# Altium project KlusterLab r2.0.PrjPcb (part 6 of 10)

## Sheet System Clocks.SchDoc
size A3; SheetNumber: 29; SheetTotal: 32
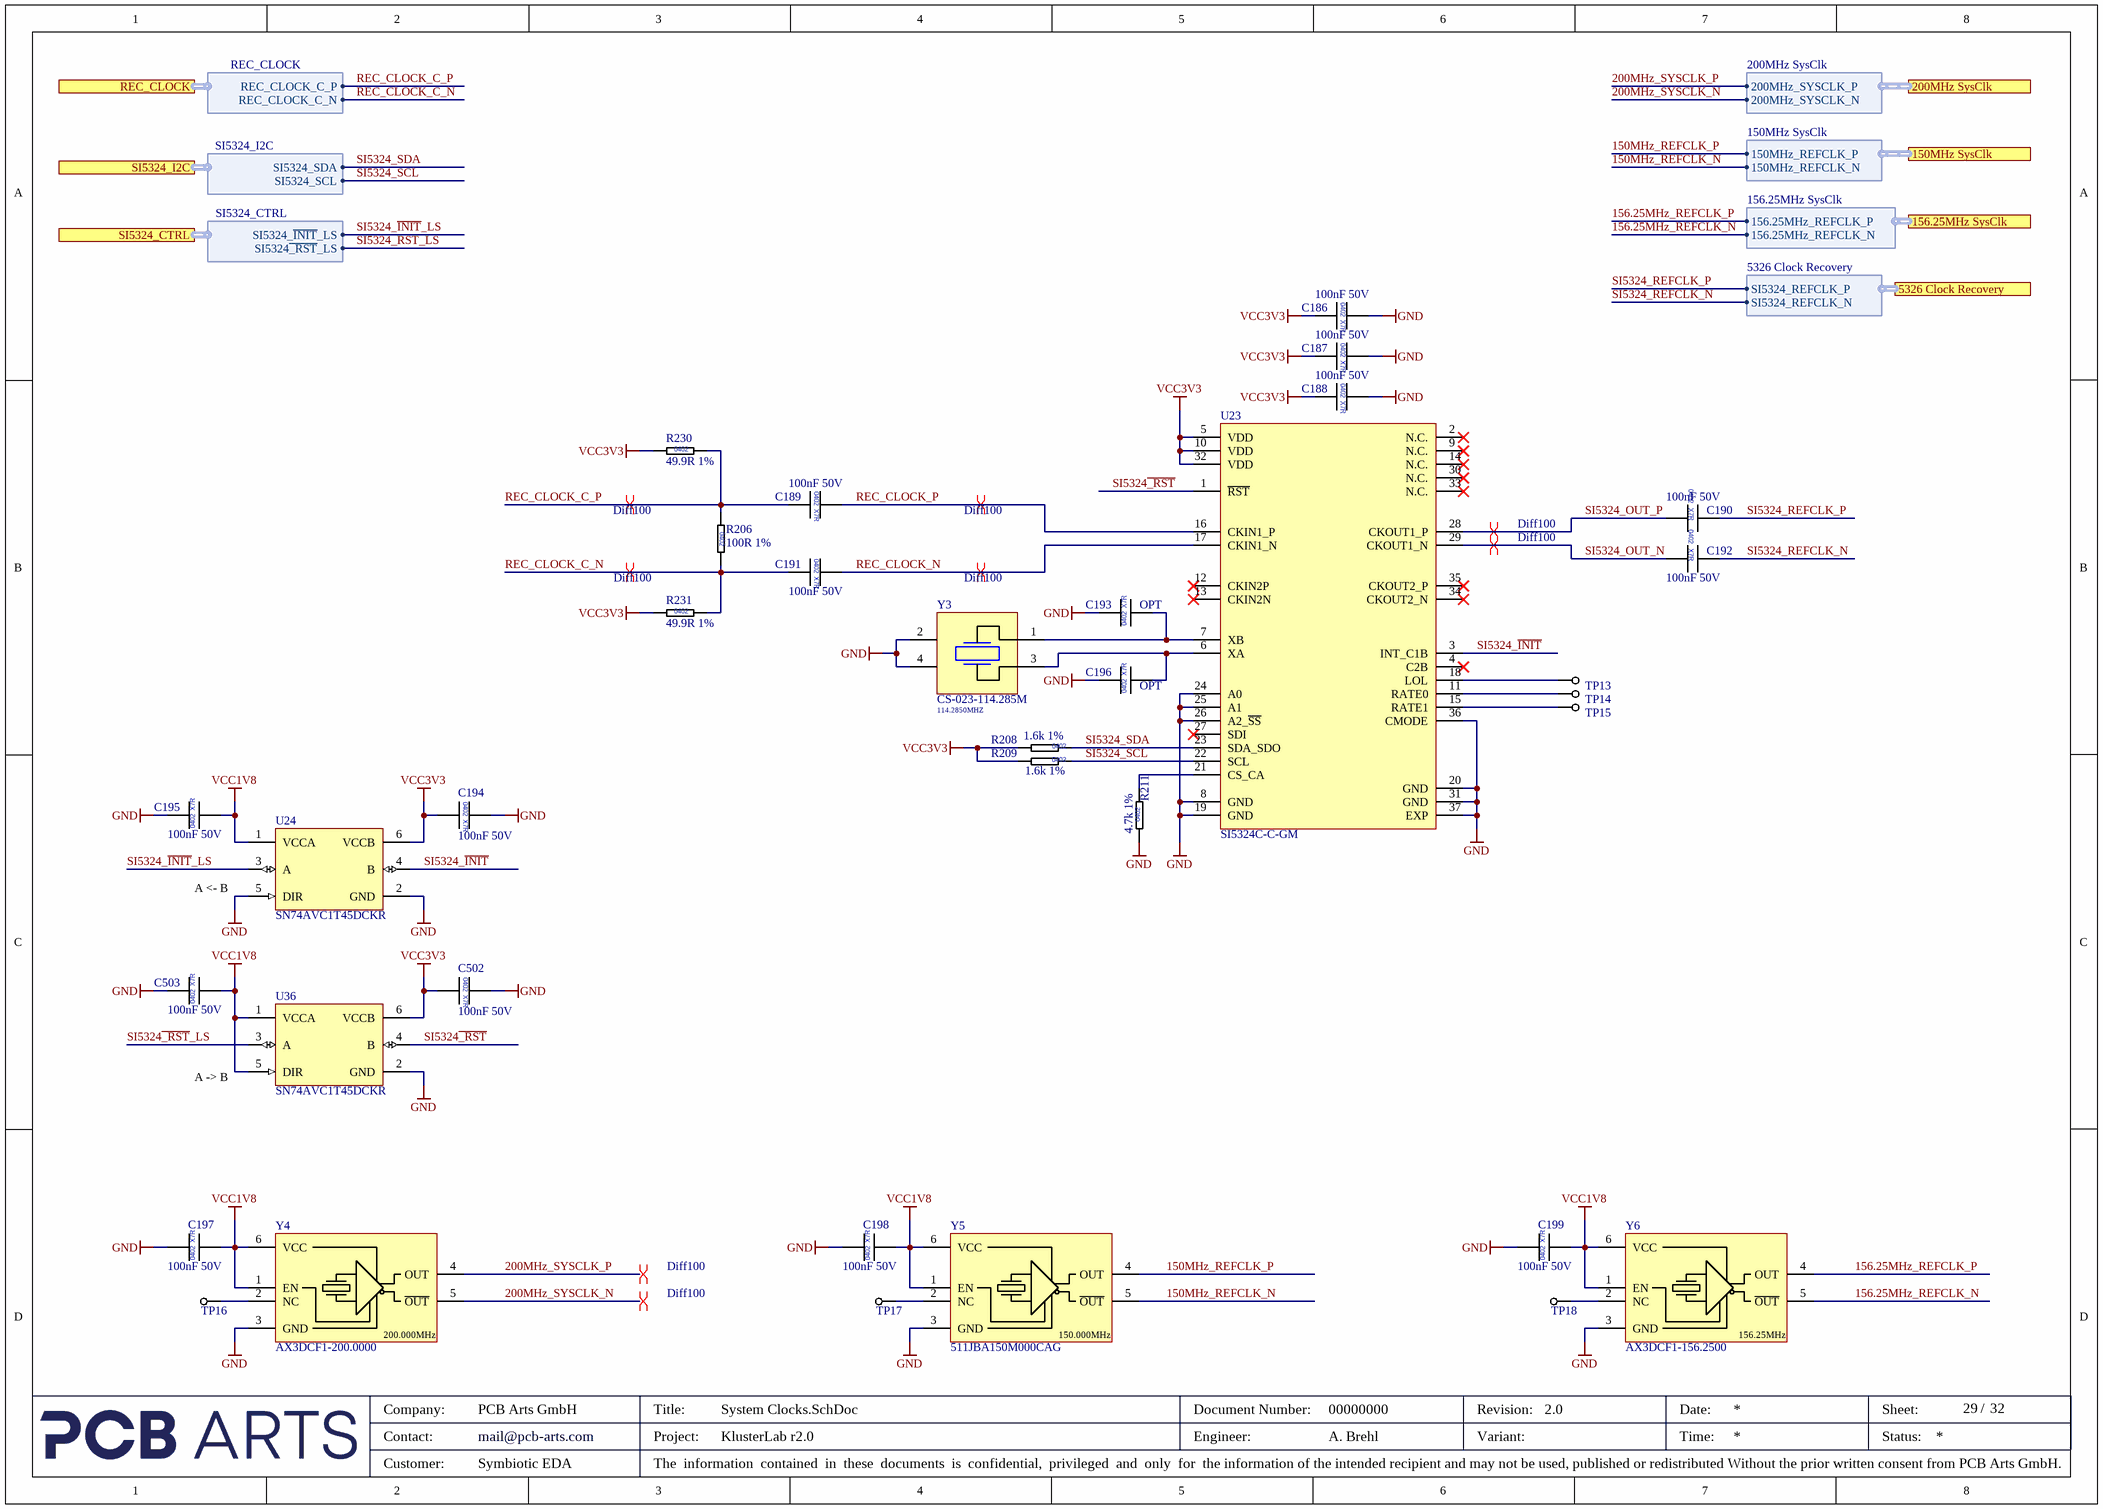
[diagram p15: System Clocks.SchDoc]

### Parts
C186  100nF 50V  [CAP_0402_L]
C187  100nF 50V  [CAP_0402_L]
C188  100nF 50V  [CAP_0402_L]
C189  100nF 50V  [CAP_0402_L]
C190  100nF 50V  [CAP_0402_L]
C191  100nF 50V  [CAP_0402_L]
C192  100nF 50V  [CAP_0402_L]
C193  OPT  [CAP_0402_L]
C194  100nF 50V  [CAP_0402_L]
C195  100nF 50V  [CAP_0402_L]
C196  OPT  [CAP_0402_L]
C197  100nF 50V  [CAP_0402_L]
C198  100nF 50V  [CAP_0402_L]
C199  100nF 50V  [CAP_0402_L]
C502  100nF 50V  [CAP_0402_L]
C503  100nF 50V  [CAP_0402_L]
R206  100R 1%  [RES_0402_L]
R208  1.6k 1%  [RES_0402_L]
R209  1.6k 1%  [RES_0402_L]
R211  4.7k 1%  [RES_0402_L]
R230  49.9R 1%  [RES_0402_L]
R231  49.9R 1%  [RES_0402_L]
TP13  Testpoint  [Testpoint 0.8mm]  (value not drawn)  (no BOM)
TP14  Testpoint  [Testpoint 0.8mm]  (value not drawn)  (no BOM)
TP15  Testpoint  [Testpoint 0.8mm]  (value not drawn)  (no BOM)
TP16  Testpoint  [Testpoint 0.8mm]  (value not drawn)  (no BOM)
TP17  Testpoint  [Testpoint 0.8mm]  (value not drawn)  (no BOM)
TP18  Testpoint  [Testpoint 0.8mm]  (value not drawn)  (no BOM)
U23  SI5324C-C-GM  [QFN50P600X600X85-37N]
U24  SN74AVC1T45DCKR  [SOT65P210X100-6N]
U36  SN74AVC1T45DCKR  [SOT65P210X100-6N]
Y3  CS-023-114.285M  Frequency: 114.2850MHZ  [S3D - Shenzhen SCTF Elec]
Y4  AX3DCF1-200.0000  [Abracon AX3]
Y5  511JBA150M000CAG  [Abracon AX3]
Y6  AX3DCF1-156.2500  [Abracon AX3]

### Ports
150MHz SysClk (harness 150MHz SysClk, see Top-Level-Sheet[6A], MGT Banks 115-116[8D]), 156.25MHz SysClk (harness 156.25MHz SysClk, see Top-Level-Sheet[6A], MGT Banks 115-116[8D]), 200MHz SysClk (harness 200MHz SysClk, see Top-Level-Sheet[6A], DDR3 Memory_Banks 32-33-34[8C]), 5326 Clock Recovery (harness 5326 Clock Recovery, see Top-Level-Sheet[6B], MGT Banks 115-116[8D]), REC_CLOCK (harness REC_CLOCK, see Top-Level-Sheet[6B], Bank 13_Bank 15_Bank 16[8A]), SI5324_CTRL (harness SI5324_CTRL, see Top-Level-Sheet[6A], SMI Bank 12[1C]), SI5324_I2C (harness SI5324_I2C, see Top-Level-Sheet[6B], I2C Multiplexer[7B])

### Harnesses
150MHz SysClk: 150MHz_REFCLK_P, 150MHz_REFCLK_N
156.25MHz SysClk: 156.25MHz_REFCLK_P, 156.25MHz_REFCLK_N
5326 Clock Recovery: SI5324_REFCLK_P, SI5324_REFCLK_N
200MHz SysClk: 200MHz_SYSCLK_P, 200MHz_SYSCLK_N
REC_CLOCK: REC_CLOCK_C_P, REC_CLOCK_C_N
SI5324_I2C: SI5324_SDA, SI5324_SCL
SI5324_CTRL: SI5324_~{INIT}_LS, SI5324~{_RST}_LS

### Nets
GND: C186.1 C187.1 C188.1 C193.1 C194.1 C195.1 C196.1 C197.1 C198.1 C199.1 C502.1 C503.1 R211.1 U23.8(GND) U23.19(GND) U23.20(GND) U23.24(A0) U23.25(A1) U23.26(A2_~{SS}) U23.31(GND) U23.36(CMODE) U23.37(EXP) U24.2(GND) U24.5(DIR) U36.2(GND) Y3.2 Y3.4 Y4.3(GND) Y5.3(GND) Y6.3(GND)
VCC1V8: C195.2 C197.2 C198.2 C199.2 C503.2 U24.1(VCCA) U36.1(VCCA) U36.5(DIR) Y4.1(EN) Y4.6(VCC) Y5.1(EN) Y5.6(VCC) Y6.1(EN) Y6.6(VCC)
VCC3V3: C186.2 C187.2 C188.2 C194.2 C502.2 R208.2 R209.2 R230.1 R231.1 U23.5(VDD) U23.10(VDD) U23.32(VDD) U24.6(VCCB) U36.6(VCCB)
150MHz_REFCLK_N: Y5.5(~{OUT}) ; port 150MHz SysClk.150MHz_REFCLK_N
150MHz_REFCLK_P: Y5.4(OUT) ; port 150MHz SysClk.150MHz_REFCLK_P
156.25MHz_REFCLK_N: Y6.5(~{OUT}) ; port 156.25MHz SysClk.156.25MHz_REFCLK_N
156.25MHz_REFCLK_P: Y6.4(OUT) ; port 156.25MHz SysClk.156.25MHz_REFCLK_P
200MHz_SYSCLK_N: Y4.5(~{OUT}) ; port 200MHz SysClk.200MHz_SYSCLK_N
200MHz_SYSCLK_P: Y4.4(OUT) ; port 200MHz SysClk.200MHz_SYSCLK_P
REC_CLOCK_C_N: C191.2 R206.2 R231.2 ; port REC_CLOCK.REC_CLOCK_C_N
REC_CLOCK_C_P: C189.2 R206.1 R230.2 ; port REC_CLOCK.REC_CLOCK_C_P
REC_CLOCK_N: C191.1 U23.17(CKIN1_N)
REC_CLOCK_P: C189.1 U23.16(CKIN1_P)
SI5324~{_RST}: U23.1(~{RST}) U36.4(B)
SI5324~{_RST}_LS: U36.3(A) ; port SI5324_CTRL.SI5324~{_RST}_LS
SI5324_~{INIT}: U23.3(INT_C1B) U24.4(B)
SI5324_~{INIT}_LS: U24.3(A) ; port SI5324_CTRL.SI5324_~{INIT}_LS
SI5324_OUT_N: C192.1 U23.29(CKOUT1_N)
SI5324_OUT_P: C190.1 U23.28(CKOUT1_P)
SI5324_REFCLK_N: C192.2 ; port 5326 Clock Recovery.SI5324_REFCLK_N
SI5324_REFCLK_P: C190.2 ; port 5326 Clock Recovery.SI5324_REFCLK_P
SI5324_SCL: R209.1 U23.22(SCL) ; port SI5324_I2C.SI5324_SCL
SI5324_SDA: R208.1 U23.23(SDA_SDO) ; port SI5324_I2C.SI5324_SDA
NetC193_2: C193.2 U23.7(XB) Y3.1
NetC196_2: C196.2 U23.6(XA) Y3.3
NetR211_2: R211.2 U23.21(CS_CA)
NetTP13_1: TP13.1(GND) U23.18(LOL)
NetTP14_1: TP14.1(GND) U23.11(RATE0)
NetTP15_1: TP15.1(GND) U23.15(RATE1)
NetTP16_1: TP16.1(GND) Y4.2(NC)
NetTP17_1: TP17.1(GND) Y5.2(NC)
NetTP18_1: TP18.1(GND) Y6.2(NC)

Not connected (* = marked no-connect by the designer): U23 2(N.C.)* 4(C2B)* 9(N.C.)* 12(CKIN2P)* 13(CKIN2N)* 14(N.C.)* 27(SDI)* 30(N.C.)* 33(N.C.)* 34(CKOUT2_N)* 35(CKOUT2_P)*

### Layout directives
differential pair; net class Diff100: 200MHz_SYSCLK_N, 200MHz_SYSCLK_P, REC_CLOCK_C_N, REC_CLOCK_C_P, REC_CLOCK_N, REC_CLOCK_P, SI5324_OUT_N, SI5324_OUT_P

### Notes on the sheet
- A <- B
- (near U36) A -> B
- Company:
- Contact:
- Customer:
- mail@pcb-arts.com
- PCB Arts GmbH
- Title:
- Project:
- The  information  contained  in  these  documents  is  confidential,  privileged  and  only  for  the information of the intended recipient and may not be used, published or redistributed Without the prior written consent from PCB Arts GmbH.
- Engineer:
- Document Number:
- Revision:
- Variant:
- Date:
- Time:
- Sheet:
- Status:
- /
- (in symbol 511JBA150M000CAG_150MHz Clock Oscillator, 1V8, LVDS) 150.000MHz
- (in symbol AX3DCF1-156.2500_156.25MHz Clock Oscillator, 1V8, LVDS) 156.25MHz
- (in symbol AX3DCF1-200.0000_200MHz Clock Oscillator, 1V8, LVDS) 200.000MHz
- (in symbol CAP_0402_100nF_50V) 0402; X7R
- (in symbol CAP_0402_OPT) X7R; 0402
- (in symbol RES_0402_1.6k_1%) 0402
- (in symbol RES_0402_4.7k_1%) 0402
- (in symbol RES_0402_49.9R_1%) 0402
- (in symbol RES_0402_100R_1%) 0402

### Library data of the parts
C186-C192 C194 C195 C197-C199 C502 C503 = CAP_0402_100nF_50V: as C88 on sheet SFP+_Connectors; Manufacturer 2: TDK
C193 C196 = CAP_0402_OPT: Multilayer Ceramic Capacitors MLCC - SMD/SMT 0402 Optional Placeholder
R206 = RES_0402_100R_1%: Thick Film Resistors - SMD 100Ohm 1%; Manufacturer 1: Vishay / Dale; Manufacturer 1 Prt. Nr.: CRCW0402100RFKEE; Manufacturer 2 Prt. Nr.: RC0402FR-7W100RL; Manufacturer 2: Yageo
R208 R209 = RES_0402_1.6k_1%: as R87-R90 on sheet SMI Bank 12; Manufacturer 2: Yageo
R211 = RES_0402_4.7k_1%: as R20-R25 on sheet SFP+_Connectors; Manufacturer 2: Yageo
R230 R231 = RES_0402_49.9R_1%: Thick Film Resistors - SMD 49.9Ohm 1%; Manufacturer 1: Vishay / Dale; Manufacturer 1 Prt. Nr.: CRCW040249R9FKEDC; Manufacturer 2 Prt. Nr.: RC0402FR-7W49R9L; Manufacturer 2: Yageo
TP13-TP18 = Testpoint 0.8mm
U23 = SI5324C-C-GM_PRECISION CLOCK MULTIPLIER/ JITTER ATTENUATOR: PRECISION CLOCK MULTIPLIER/ JITTER ATTENUATOR; Manufacturer 1: Skyworks Solutions, Inc.; Manufacturer 1 Prt. Nr.: SI5324C-C-GM
U24 U36 = SN74AVC1T45DCKR_Single-Bit Dual-Supply Bus Transceiver: Single-Bit Dual-Supply Bus Transceiver with Configurable Voltage Translation and 3-State Outputs; Manufacturer 1: Texas Instruments; Manufacturer 1 Prt. Nr.: SN74AVC1T45DCKR
Y3 = Quarz 114.2850MHz ESR 80R 18pF: 3.2 x 2.5 x 0.8 mm SMD Crystal; Manufacturer 1: Connor Winfield; Manufacturer 1 Prt. Nr.: CS-023-114.285M
Y4 = AX3DCF1-200.0000_200MHz Clock Oscillator, 1V8, LVDS: 200MHz Clock Oscillator, 1V8, LVDS; Manufacturer 1: Abracon; Manufacturer 1 Prt. Nr.: AX3DCF1-200.0000
Y5 = 511JBA150M000CAG_150MHz Clock Oscillator, 1V8, LVDS: 150MHz Clock Oscillator, 1V8, LVDS; Manufacturer 1: Skyworks Solutions, Inc.; Manufacturer 1 Prt. Nr.: 511JBA150M000CAG
Y6 = AX3DCF1-156.2500_156.25MHz Clock Oscillator, 1V8, LVDS: 156.25MHz Clock Oscillator, 1V8, LVDS; Manufacturer 1: Abracon; Manufacturer 1 Prt. Nr.: AX3DCF1-156.2500